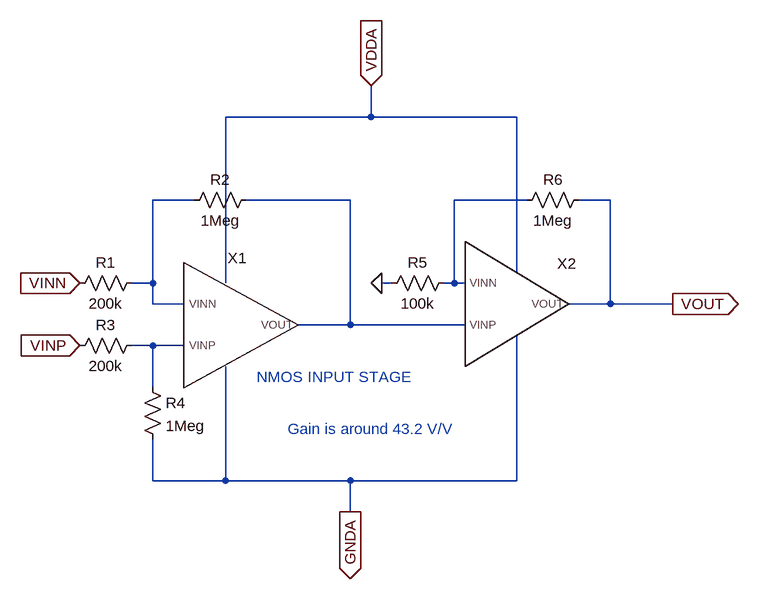
[diagram p0: schematic PFM_mode_detector.asc]
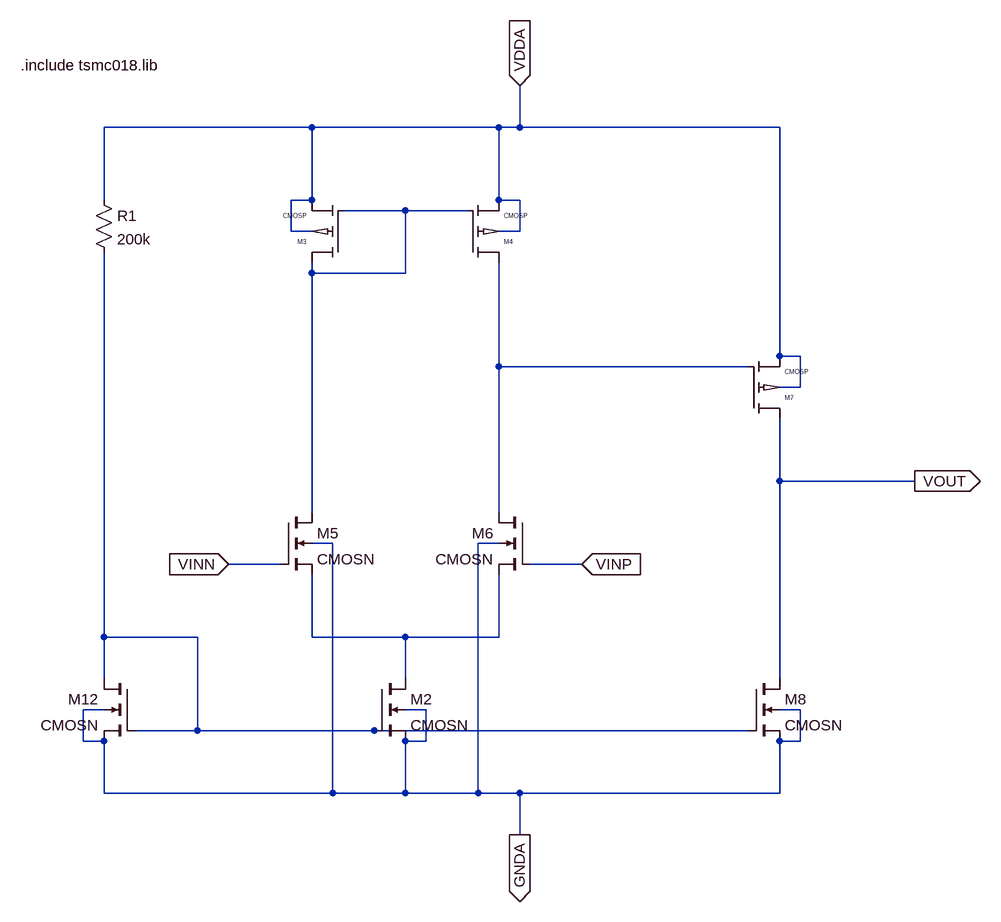
[diagram p1: sub-circuit error_amplifier.asc]
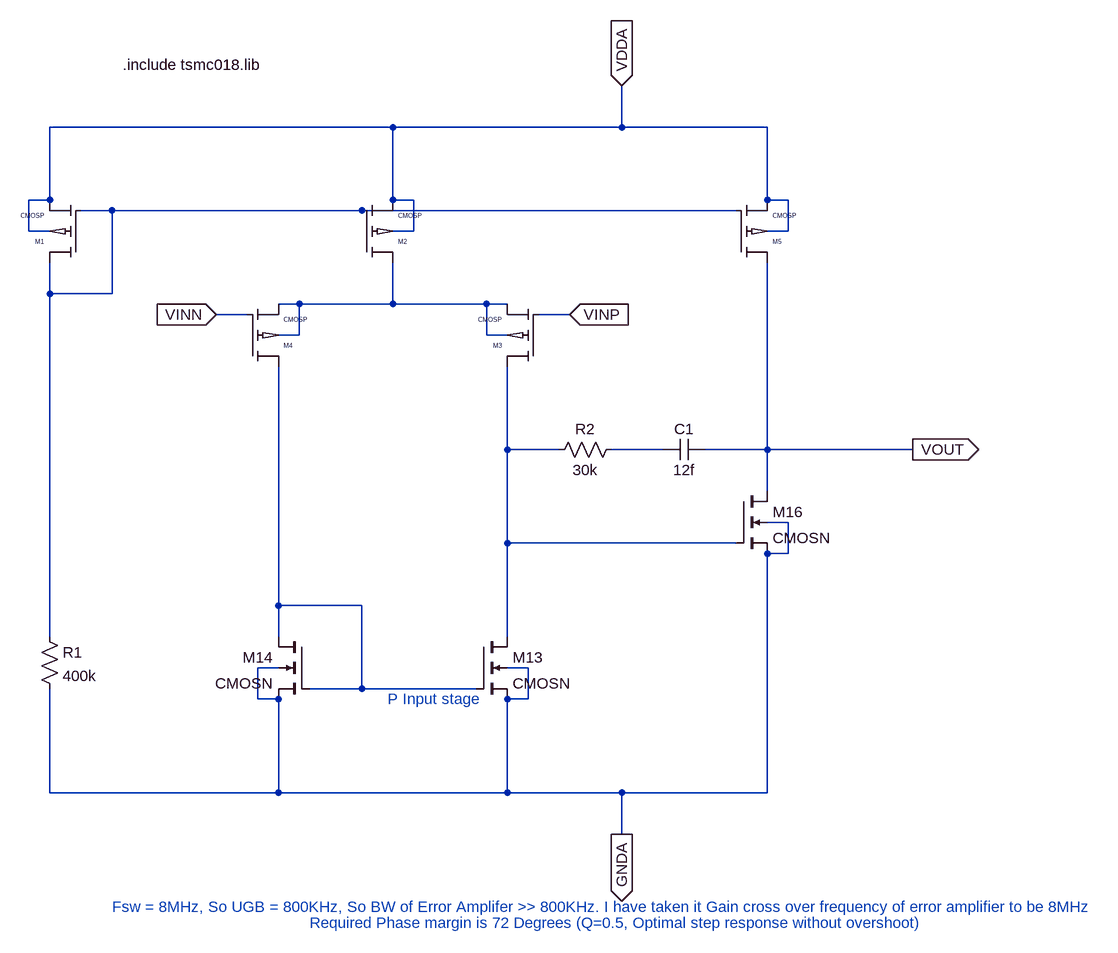
[diagram p2: sub-circuit pmos_error_amplifier.asc]
PFM_mode_detector.asc, the LTspice schematic file:
Version 4
SHEET 1 880 680
WIRE 288 -144 288 -192
WIRE 288 -144 64 -144
WIRE 512 -144 288 -144
WIRE 16 -16 -48 -16
WIRE 256 -16 96 -16
WIRE 528 -16 416 -16
WIRE 656 -16 608 -16
WIRE 512 96 512 -144
WIRE -48 112 -48 -16
WIRE -48 112 -80 112
WIRE 64 112 64 -144
WIRE 320 112 304 112
WIRE 416 112 416 -16
WIRE 416 112 400 112
WIRE 432 112 416 112
WIRE -48 144 -48 112
WIRE 0 144 -48 144
WIRE 656 144 656 -16
WIRE 656 144 592 144
WIRE 752 144 656 144
WIRE 256 176 256 -16
WIRE 256 176 176 176
WIRE 432 176 256 176
WIRE -48 208 -80 208
WIRE 0 208 -48 208
WIRE -48 272 -48 208
WIRE -48 416 -48 352
WIRE 64 416 64 240
WIRE 64 416 -48 416
WIRE 256 416 64 416
WIRE 512 416 512 192
WIRE 512 416 256 416
WIRE 256 464 256 416
FLAG 304 112 0
FLAG 288 -192 VDDA
IOPIN 288 -192 In
FLAG 256 464 GNDA
IOPIN 256 464 Out
FLAG -160 208 VINP
IOPIN -160 208 In
FLAG -160 112 VINN
IOPIN -160 112 In
FLAG 752 144 VOUT
IOPIN 752 144 Out
SYMBOL Error_Amplifier 80 192 R0
SYMATTR InstName X1
SYMBOL res -64 96 R90
WINDOW 0 0 56 VBottom 2
WINDOW 3 32 56 VTop 2
SYMATTR InstName R1
SYMATTR Value 200k
SYMBOL res 112 -32 R90
WINDOW 0 0 56 VBottom 2
WINDOW 3 32 56 VTop 2
SYMATTR InstName R2
SYMATTR Value 1Meg
SYMBOL res -64 192 R90
WINDOW 0 0 56 VBottom 2
WINDOW 3 32 56 VTop 2
SYMATTR InstName R3
SYMATTR Value 200k
SYMBOL res -64 256 R0
SYMATTR InstName R4
SYMATTR Value 1Meg
SYMBOL res 416 96 R90
WINDOW 0 0 56 VBottom 2
WINDOW 3 32 56 VTop 2
SYMATTR InstName R5
SYMATTR Value 100k
SYMBOL res 624 -32 R90
WINDOW 0 0 56 VBottom 2
WINDOW 3 32 56 VTop 2
SYMATTR InstName R6
SYMATTR Value 1Meg
SYMBOL Pmos_Error_Amplifier 512 160 R0
SYMATTR InstName X2
TEXT 112 256 Left 2 ;NMOS INPUT STAGE
TEXT 160 336 Left 2 ;Gain is around 43.2 V/V

error_amplifier.asc, the sub-circuit schematic file:
Version 4
SHEET 1 2700 752
WIRE -384 -1360 -704 -1360
WIRE -96 -1360 -384 -1360
WIRE -64 -1360 -64 -1424
WIRE -64 -1360 -96 -1360
WIRE 336 -1360 -64 -1360
WIRE -704 -1248 -704 -1360
WIRE -384 -1248 -384 -1360
WIRE -384 -1248 -416 -1248
WIRE -96 -1248 -96 -1360
WIRE -64 -1248 -96 -1248
WIRE -240 -1232 -336 -1232
WIRE -144 -1232 -240 -1232
WIRE -416 -1200 -416 -1248
WIRE -384 -1200 -416 -1200
WIRE -64 -1200 -64 -1248
WIRE -64 -1200 -96 -1200
WIRE -384 -1136 -384 -1152
WIRE -240 -1136 -240 -1232
WIRE -240 -1136 -384 -1136
WIRE 336 -1008 336 -1360
WIRE 368 -1008 336 -1008
WIRE -96 -992 -96 -1152
WIRE 288 -992 -96 -992
WIRE 368 -960 368 -1008
WIRE 368 -960 336 -960
WIRE 336 -816 336 -912
WIRE 544 -816 336 -816
WIRE -384 -768 -384 -1136
WIRE -96 -768 -96 -992
WIRE -352 -720 -384 -720
WIRE -96 -720 -128 -720
WIRE -432 -688 -512 -688
WIRE 32 -688 -48 -688
WIRE -704 -576 -704 -1168
WIRE -560 -576 -704 -576
WIRE -384 -576 -384 -672
WIRE -240 -576 -384 -576
WIRE -96 -576 -96 -672
WIRE -96 -576 -240 -576
WIRE -704 -512 -704 -576
WIRE -240 -512 -240 -576
WIRE 336 -512 336 -816
WIRE -704 -464 -736 -464
WIRE -208 -464 -240 -464
WIRE 368 -464 336 -464
WIRE -560 -432 -560 -576
WIRE -560 -432 -656 -432
WIRE -288 -432 -560 -432
WIRE 288 -432 -288 -432
WIRE -736 -416 -736 -464
WIRE -704 -416 -736 -416
WIRE -208 -416 -208 -464
WIRE -208 -416 -240 -416
WIRE 368 -416 368 -464
WIRE 368 -416 336 -416
WIRE -704 -336 -704 -416
WIRE -352 -336 -352 -720
WIRE -352 -336 -704 -336
WIRE -240 -336 -240 -416
WIRE -240 -336 -352 -336
WIRE -128 -336 -128 -720
WIRE -128 -336 -240 -336
WIRE -64 -336 -128 -336
WIRE 336 -336 336 -416
WIRE 336 -336 -64 -336
WIRE -64 -272 -64 -336
FLAG -64 -1424 VDDA
IOPIN -64 -1424 In
FLAG -64 -272 GNDA
IOPIN -64 -272 Out
FLAG 544 -816 VOUT
IOPIN 544 -816 Out
FLAG -512 -688 VINN
IOPIN -512 -688 In
FLAG 32 -688 VINP
IOPIN 32 -688 In
SYMBOL cmosn -656 -512 M0
SYMATTR InstName M12
SYMATTR Value2 l=180n w=1u
SYMBOL cmosn -288 -512 R0
SYMATTR InstName M2
SYMATTR Value2 l=180n w=5u
SYMBOL cmosp -336 -1152 R180
SYMATTR InstName M3
SYMATTR Value2 l=360n w=3u
SYMBOL cmosp -144 -1152 M180
SYMATTR InstName M4
SYMATTR Value2 l=360n w=3u
SYMBOL cmosn -432 -768 R0
SYMATTR InstName M5
SYMATTR Value2 l=360n w=10u
SYMBOL cmosn -48 -768 M0
SYMATTR InstName M6
SYMATTR Value2 l=360n w=10u
SYMBOL cmosp 288 -912 M180
SYMATTR InstName M7
SYMATTR Value2 l=180n w=5u
SYMBOL cmosn 288 -512 R0
SYMATTR InstName M8
SYMATTR Value2 l=180n w=1u
SYMBOL res -720 -1264 R0
SYMATTR InstName R1
SYMATTR Value 200k
TEXT -832 -1456 Left 2 !.include tsmc018.lib

pmos_error_amplifier.asc, the sub-circuit schematic file:
Version 4
SHEET 1 1692 888
WIRE -320 -352 -848 -352
WIRE 32 -352 32 -416
WIRE 32 -352 -320 -352
WIRE 256 -352 32 -352
WIRE -848 -240 -848 -352
WIRE -848 -240 -880 -240
WIRE -320 -240 -320 -352
WIRE -288 -240 -320 -240
WIRE 256 -240 256 -352
WIRE 288 -240 256 -240
WIRE -752 -224 -800 -224
WIRE -368 -224 -752 -224
WIRE 208 -224 -368 -224
WIRE -880 -192 -880 -240
WIRE -848 -192 -880 -192
WIRE -288 -192 -288 -240
WIRE -288 -192 -320 -192
WIRE 288 -192 288 -240
WIRE 288 -192 256 -192
WIRE -848 -96 -848 -144
WIRE -752 -96 -752 -224
WIRE -752 -96 -848 -96
WIRE -464 -80 -496 -80
WIRE -320 -80 -320 -144
WIRE -320 -80 -464 -80
WIRE -176 -80 -320 -80
WIRE -144 -80 -176 -80
WIRE -544 -64 -592 -64
WIRE -48 -64 -96 -64
WIRE -464 -32 -464 -80
WIRE -464 -32 -496 -32
WIRE -176 -32 -176 -80
WIRE -144 -32 -176 -32
WIRE -144 144 -144 16
WIRE -64 144 -144 144
WIRE 96 144 16 144
WIRE 256 144 256 -144
WIRE 256 144 160 144
WIRE 480 144 256 144
WIRE 256 208 256 144
WIRE 288 256 256 256
WIRE -144 288 -144 144
WIRE 208 288 -144 288
WIRE 288 304 288 256
WIRE 288 304 256 304
WIRE -496 384 -496 16
WIRE -368 384 -496 384
WIRE -848 432 -848 -96
WIRE -496 432 -496 384
WIRE -144 432 -144 288
WIRE -496 480 -528 480
WIRE -112 480 -144 480
WIRE -368 512 -368 384
WIRE -368 512 -448 512
WIRE -192 512 -368 512
WIRE -528 528 -528 480
WIRE -496 528 -528 528
WIRE -112 528 -112 480
WIRE -112 528 -144 528
WIRE -848 672 -848 512
WIRE -496 672 -496 528
WIRE -496 672 -848 672
WIRE -144 672 -144 528
WIRE -144 672 -496 672
WIRE 32 672 -144 672
WIRE 256 672 256 304
WIRE 256 672 32 672
WIRE 32 736 32 672
FLAG -592 -64 VINN
IOPIN -592 -64 In
FLAG -48 -64 VINP
IOPIN -48 -64 In
FLAG 32 -416 VDDA
IOPIN 32 -416 In
FLAG 32 736 GNDA
IOPIN 32 736 Out
FLAG 480 144 VOUT
IOPIN 480 144 Out
SYMBOL cmosp -800 -144 R180
SYMATTR InstName M1
SYMATTR Value2 l=180n w=5u
SYMBOL cmosp -368 -144 M180
SYMATTR InstName M2
SYMATTR Value2 l=180n w=5u
SYMBOL cmosp -96 16 R180
SYMATTR InstName M3
SYMATTR Value2 l=180n w=2u
SYMBOL cmosp -544 16 M180
SYMATTR InstName M4
SYMATTR Value2 l=180n w=2u
SYMBOL cmosn 208 208 R0
SYMATTR InstName M16
SYMATTR Value2 l=180n w=1u
SYMBOL cmosn -192 432 R0
SYMATTR InstName M13
SYMATTR Value2 l=360n w=1u
SYMBOL cmosn -448 432 M0
SYMATTR InstName M14
SYMATTR Value2 l=360n w=1u
SYMBOL res -864 416 R0
SYMATTR InstName R1
SYMATTR Value 400k
SYMBOL cmosp 208 -144 M180
SYMATTR InstName M5
SYMATTR Value2 l=180n w=5u
SYMBOL cap 160 128 R90
WINDOW 0 0 32 VBottom 2
WINDOW 3 32 32 VTop 2
SYMATTR InstName C1
SYMATTR Value 12f
SYMBOL res 32 128 R90
WINDOW 0 0 56 VBottom 2
WINDOW 3 32 56 VTop 2
SYMATTR InstName R2
SYMATTR Value 30k
TEXT -752 848 Left 2 ;Fsw = 8MHz, So UGB = 800KHz, So BW of Error Amplifer >> 800KHz. I have taken it Gain cross over frequency of error amplifier to be 8MHz
TEXT -736 -448 Left 2 !.include tsmc018.lib
TEXT -448 872 Left 2 ;Required Phase margin is 72 Degrees (Q=0.5, Optimal step response without overshoot)
TEXT -328 528 Left 2 ;P Input stage

The netlist it stands for:
* PFM_mode_detector.asc
XX1 VDDA N001 N004 GNDA N002 error_amplifier
R1 N001 VINN 200k
R2 N002 N001 1Meg
R3 N004 VINP 200k
R4 N004 GNDA 1Meg
R5 N003 0 100k
R6 VOUT N003 1Meg
XX2 VDDA N003 N002 GNDA VOUT pmos_error_amplifier

* block symbol definitions
.subckt error_amplifier VDDA VINN VINP GNDA VOUT
M12 N003 N003 GNDA GNDA CMOSN l=180n w=1u
M2 N004 N003 GNDA GNDA CMOSN l=180n w=5u
M3 N001 N001 VDDA VDDA CMOSP l=360n w=3u
M4 N002 N001 VDDA VDDA CMOSP l=360n w=3u
M5 N001 VINN N004 GNDA CMOSN l=360n w=10u
M6 N002 VINP N004 GNDA CMOSN l=360n w=10u
M7 VOUT N002 VDDA VDDA CMOSP l=180n w=5u
M8 VOUT N003 GNDA GNDA CMOSN l=180n w=1u
R1 VDDA N003 200k
.include tsmc018.lib
.ends error_amplifier

.subckt pmos_error_amplifier VDDA VINN VINP GNDA VOUT
M1 N001 N001 VDDA VDDA CMOSP l=180n w=5u
M2 N002 N001 VDDA VDDA CMOSP l=180n w=5u
M3 N003 VINP N002 N002 CMOSP l=180n w=2u
M4 N005 VINN N002 N002 CMOSP l=180n w=2u
M16 VOUT N003 GNDA GNDA CMOSN l=180n w=1u
M13 N003 N005 GNDA GNDA CMOSN l=360n w=1u
M14 N005 N005 GNDA GNDA CMOSN l=360n w=1u
R1 N001 GNDA 400k
M5 VOUT N001 VDDA VDDA CMOSP l=180n w=5u
C1 VOUT N004 12f
R2 N004 N003 30k
* Fsw = 8MHz, So UGB = 800KHz, So BW of Error Amplifer >> 800KHz. I have taken it Gain cross over frequency of error amplifier to be 8MHz
.include tsmc018.lib
* Required Phase margin is 72 Degrees (Q=0.5, Optimal step response without overshoot)
* P Input stage
.ends pmos_error_amplifier

.model NMOS NMOS
.model PMOS PMOS
.lib standard.mos
* NMOS INPUT STAGE
* Gain is around 43.2 V/V
.lib tsmc018.lib
.backanno
.end